# Altium schematic sheet dji_3s_battery.SchDoc: Smart Battery
size 762 x 508 mm; VersionControl_RevNumber: C; Date: Not shown in title block; DocumentNumber: 1; Revision: Use project parameter SCH_Rev; SheetNumber: 1; SheetTotal: 1; PageSetup: Record=PageOptions|CenterHorizontal=True|CenterVertical=True|PrintScale=1.00|XCorrection=1.00|YCorrection=1.00|PrintKind=0|BorderSize=5000000|LeftOffset=0|BottomOffset=0|Orientation=2|PaperLength=1000|PaperWidth=1000|Scale=100|PaperSource=15|PrintQuality=600|MediaType=1|DitherType=10|PaperKind=Letter|PrintScaleMode=1; CurrentTime: Not shown in title block; CurrentDate: Not shown in title block; Time: Not shown in title block; ModifiedDate: Not shown in title block
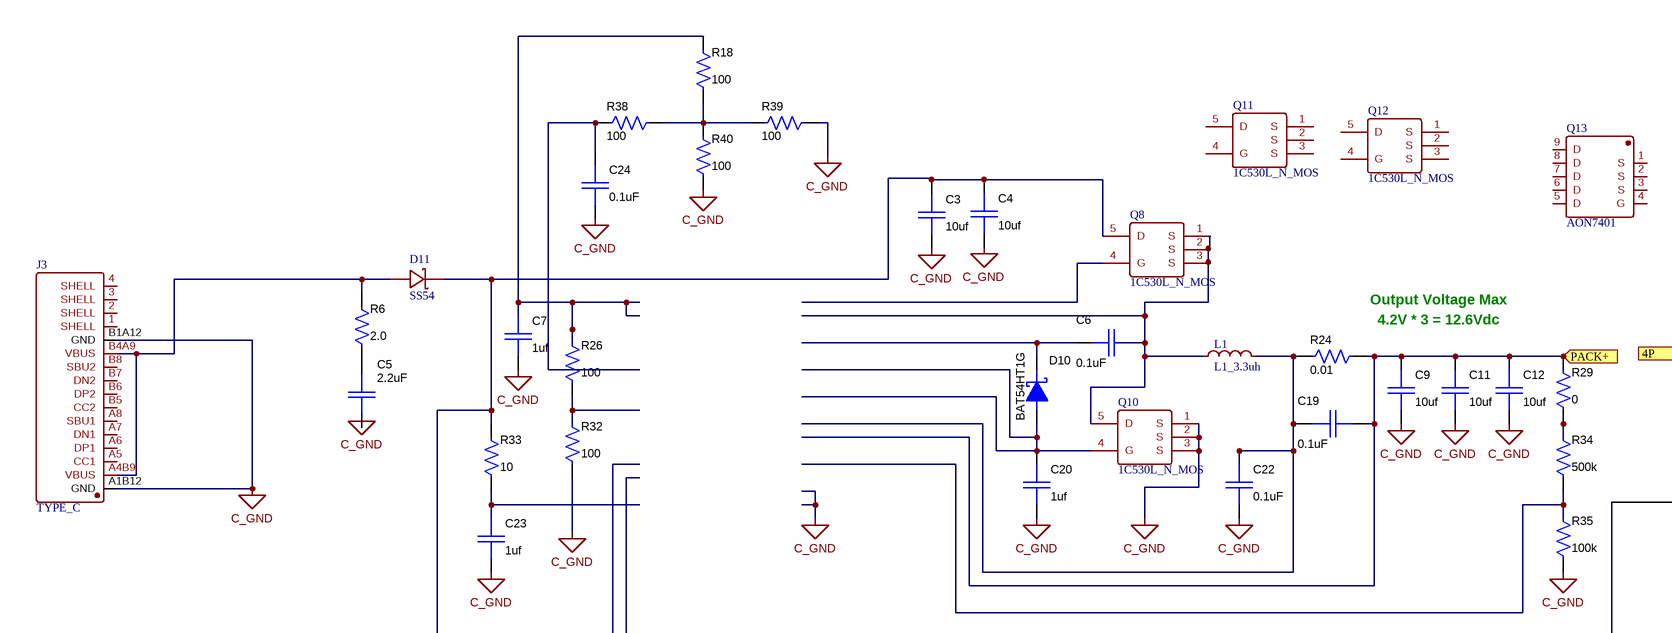
[diagram p0: dji_3s_battery.SchDoc, top left]
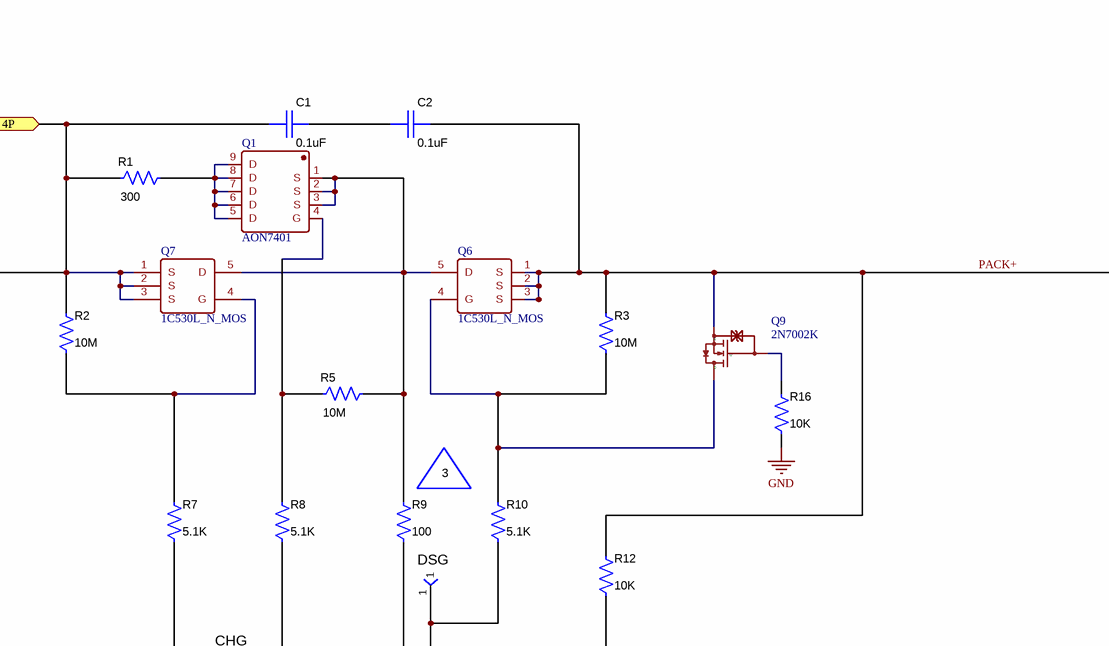
[diagram p1: dji_3s_battery.SchDoc, top right]
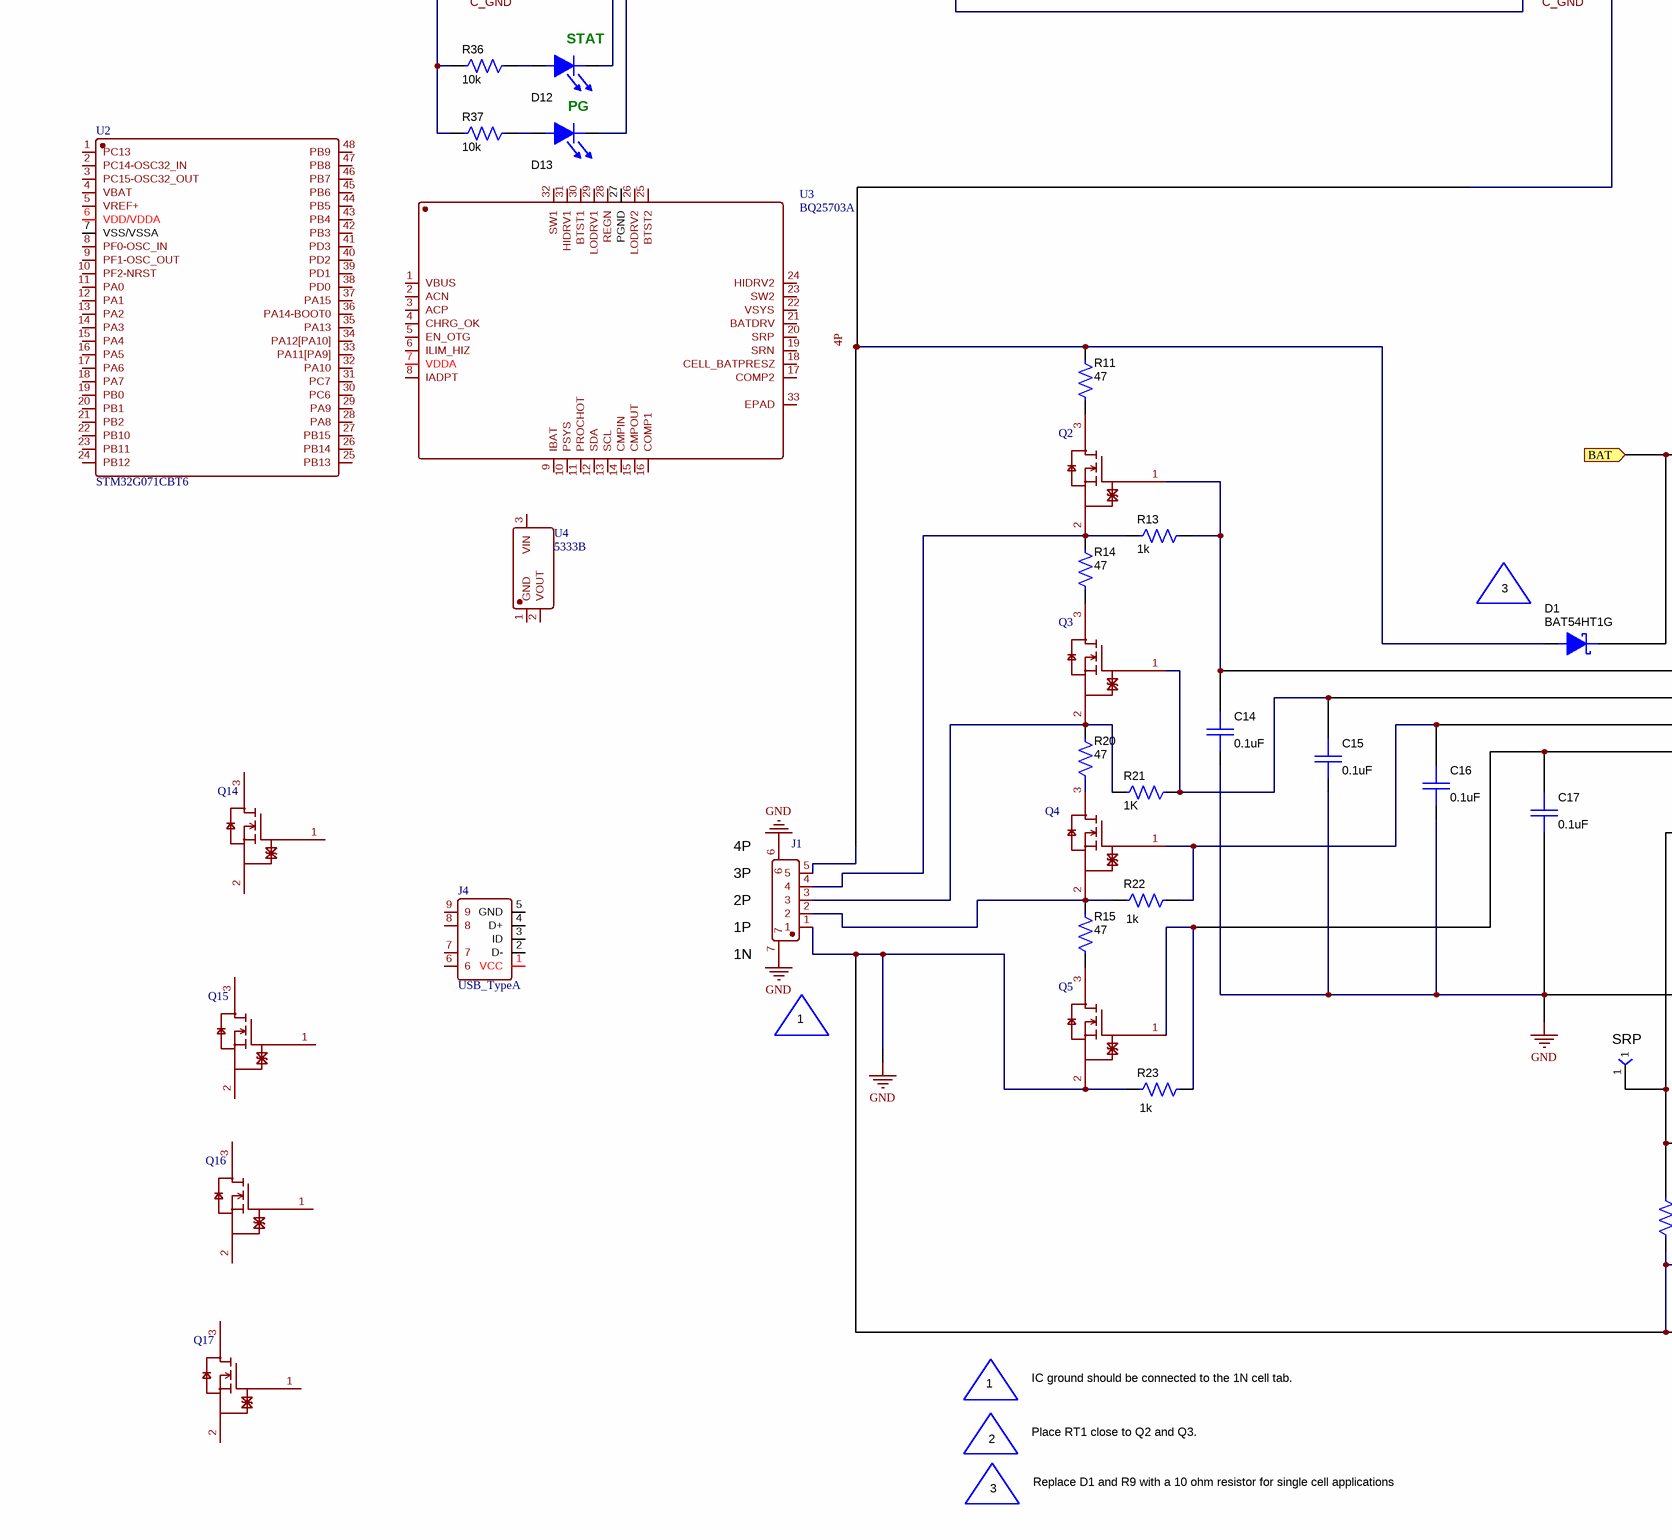
[diagram p2: dji_3s_battery.SchDoc, bottom left]
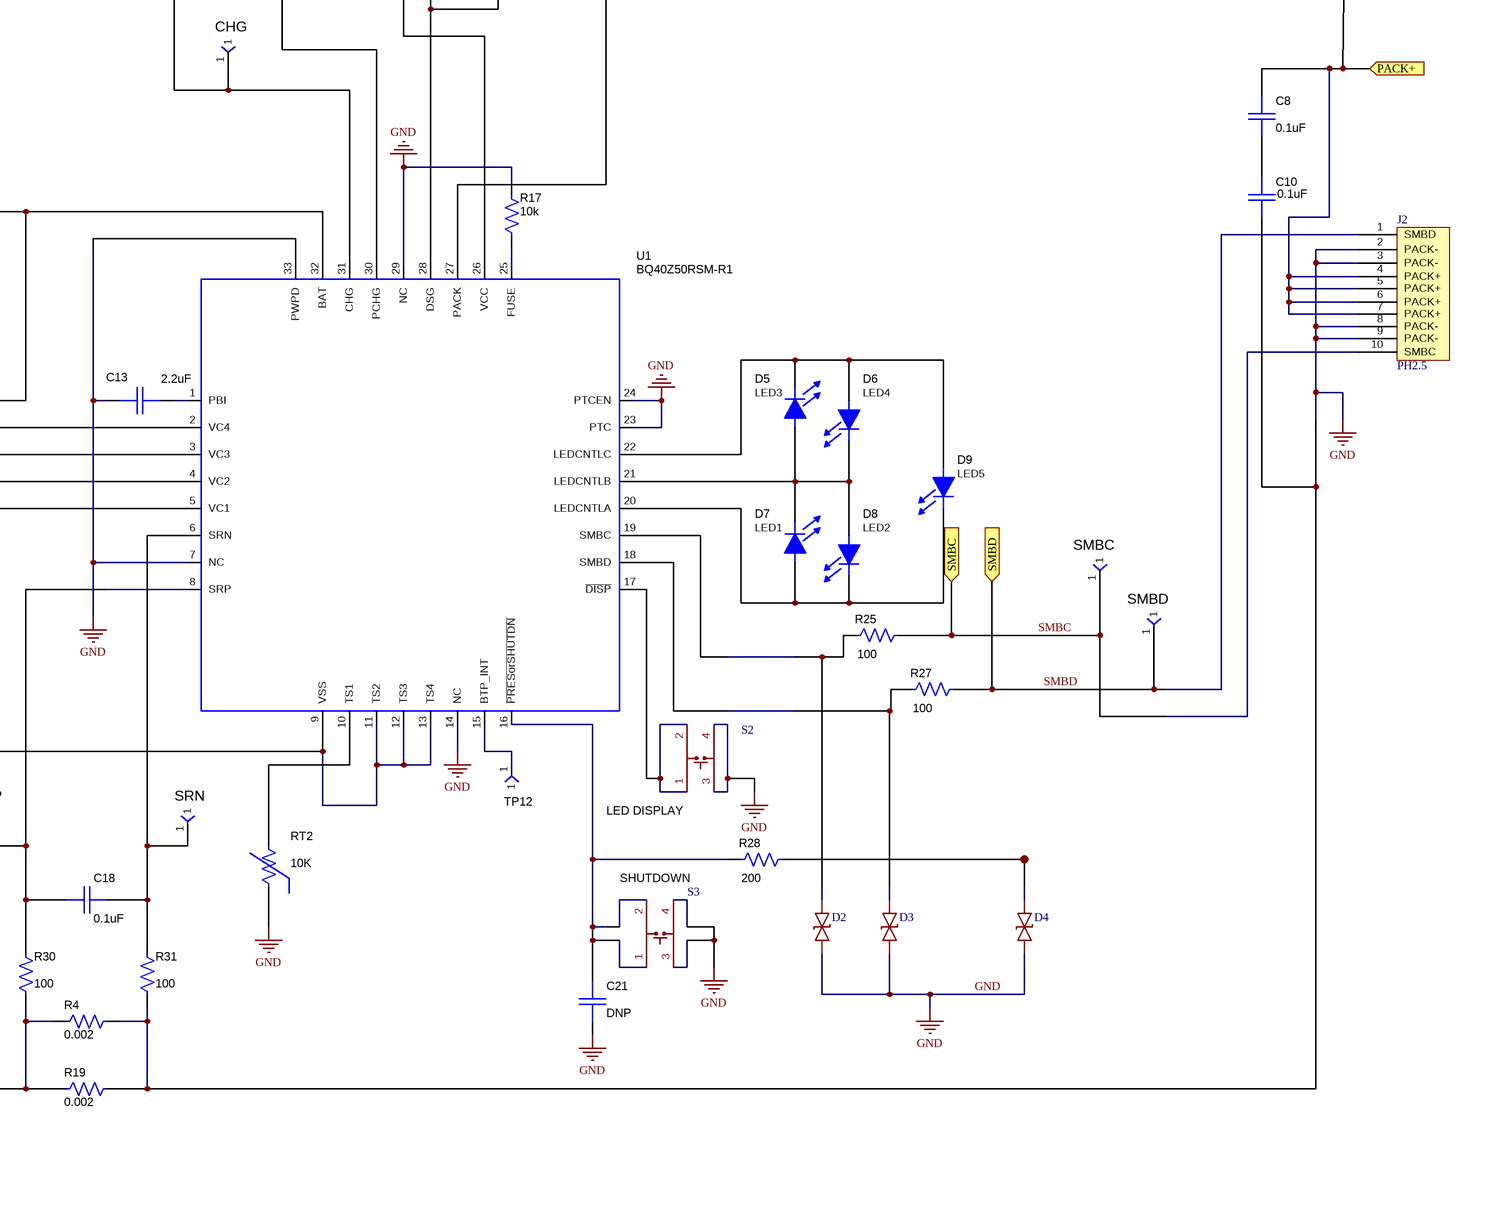
[diagram p3: dji_3s_battery.SchDoc, bottom right]

## Parts
C1  value 0.1uF  [C603]  (hidden comment: C0603C104M5RACTU)
C2  value 0.1uF  [C603]  (hidden comment: C0603C104M5RACTU)
C3  value 10uf  [C603]  (hidden comment: C0603C104M5RACTU)
C4  value 10uf  [C603]  (hidden comment: C0603C104M5RACTU)
C5  value 2.2uF  [C0805]  (hidden comment: C2012X7R1E225M085AB)
C6  value 0.1uF  [C603]  (hidden comment: C0603C104M5RACTU)
C7  value 1uf  [C603]  (hidden comment: C0603C104M5RACTU)
C8  value 0.1uF  [C603]  (hidden comment: C0603C104M5RACTU)
C9  value 10uf  [C603]  (hidden comment: C0603C104M5RACTU)
C10  value 0.1uF  [C603]  (hidden comment: C0603C104M5RACTU)
C11  value 10uf  [C603]  (hidden comment: C0603C104M5RACTU)
C12  value 10uf  [C603]  (hidden comment: C0603C104M5RACTU)
C13  value 2.2uF  [C0805]  (hidden comment: C2012X7R1E225M085AB)
C14  value 0.1uF  [C603]  (hidden comment: C0603C104M5RACTU)
C15  value 0.1uF  [C603]  (hidden comment: C0603C104M5RACTU)
C16  value 0.1uF  [C603]  (hidden comment: C0603C104M5RACTU)
C17  value 0.1uF  [C603]  (hidden comment: C0603C104M5RACTU)
C18  value 0.1uF  [C603]  (hidden comment: C0603C104M5RACTU)
C19  value 0.1uF  [C603]  (hidden comment: C0603C104M5RACTU)
C20  value 1uf  [C603]  (hidden comment: C0603C104M5RACTU)
C21  value DNP  [C603]  (hidden comment: C0603C104M5RACTU)
C22  value 0.1uF  [C603]  (hidden comment: C0603C104M5RACTU)
C23  value 1uf  [C603]  (hidden comment: C0603C104M5RACTU)
C24  value 0.1uF  [C603]  (hidden comment: C0603C104M5RACTU)
D1  value BAT54HT1G  [SOD-323]  (hidden comment: D-BAT54HT1)
D2  ESD_Diode  [ESD_Diode]  (value not drawn)
D3  ESD_Diode  [ESD_Diode]  (value not drawn)
D4  ESD_Diode  [ESD_Diode]  (value not drawn)
D5  D_LED_SML-LXR1206USBC-TR  [LED0805]  (value not drawn)
D6  D_LED_SML-LXR1206USBC-TR  [LED0805]  (value not drawn)
D7  D_LED_SML-LXR1206USBC-TR  [LED0805]  (value not drawn)
D8  D_LED_SML-LXR1206USBC-TR  [LED0805]  (value not drawn)
D9  D_LED_SML-LXR1206USBC-TR  [LED0805]  (value not drawn)
D10  value BAT54HT1G  [SOD-323]  (hidden comment: D-BAT54HT1)
D11  SS54  [SMA(DO-214AC)]
D12  D_LED_SML-LXR1206USBC-TR  [LED0805]  (value not drawn)
D13  D_LED_SML-LXR1206USBC-TR  [LED0805]  (value not drawn)
J1  SMD_1.25  [SMD_1.25]  (value not drawn)
J2  PH2.5  [PH2.5]
J3  TYPE_C  [TYPE_C]
J4  USB_TypeA  [USB_TypeA]
L1  L1_3.3uh  [3.3uh]
Q1  AON7401  [DFN-8]
Q2  DMN601K  [SOT-23 - duplicate]  (value not drawn)
Q3  DMN601K  [SOT-23 - duplicate]  (value not drawn)
Q4  DMN601K  [SOT-23 - duplicate]  (value not drawn)
Q5  DMN601K  [SOT-23 - duplicate]  (value not drawn)
Q6  1C530L_N_MOS  [LFPAK]
Q7  1C530L_N_MOS  [LFPAK]
Q8  1C530L_N_MOS  [LFPAK]
Q9  2N7002K  [2N7002K]
Q10  1C530L_N_MOS  [LFPAK]
Q11  1C530L_N_MOS  [LFPAK]
Q12  1C530L_N_MOS  [LFPAK]
Q13  AON7401  [DFN-8]
Q14  DMN601K  [SOT-23 - duplicate]  (value not drawn)
Q15  DMN601K  [SOT-23 - duplicate]  (value not drawn)
Q16  DMN601K  [SOT-23 - duplicate]  (value not drawn)
Q17  DMN601K  [SOT-23 - duplicate]  (value not drawn)
R1  value 300  [R2512]  (hidden comment: CRCW2512300RJNEG)
R2  value 10M  [0603]  (hidden comment: CRCW060310M0JNEA)
R3  value 10M  [0603]  (hidden comment: CRCW060310M0JNEA)
R4  value 0.002  [R2512]  (hidden comment: CRCW2512300RJNEG)
R5  value 10M  [0603]  (hidden comment: CRCW060310M0JNEA)
R6  value 2.0  [0603]  (hidden comment: CRCW0603100RJNEAHP)
R7  value 5.1K  [0603]  (hidden comment: CRCW06035K10JNEA)
R8  value 5.1K  [0603]  (hidden comment: CRCW06035K10JNEA)
R9  value 100  [0603]  (hidden comment: CRCW0603100RJNEAHP)
R10  value 5.1K  [0603]  (hidden comment: CRCW06035K10JNEA)
R11  value 47  [R1206]  (hidden comment: CSR1206-0R001F1)
R12  value 10K  [0603]  (hidden comment: CRCW060310K0JNEA)
R13  value 1k  [0603]  (hidden comment: CRCW0603100RJNEAHP)
R14  value 47  [R1206]  (hidden comment: CSR1206-0R001F1)
R15  value 47  [R1206]  (hidden comment: CSR1206-0R001F1)
R16  value 10K  [0603]  (hidden comment: CRCW060310M0JNEA)
R17  value 10k  [0603]  (hidden comment: CRCW06035K10JNEA)
R18  value 100  [0603]  (hidden comment: CRCW0603100RJNEAHP)
R19  value 0.002  [R2512]  (hidden comment: CRCW2512300RJNEG)
R20  value 47  [R1206]  (hidden comment: CSR1206-0R001F1)
R21  value 1K  [0603]  (hidden comment: CRCW0603100RJNEAHP)
R22  value 1k  [0603]  (hidden comment: CRCW0603100RJNEAHP)
R23  value 1k  [0603]  (hidden comment: CRCW0603100RJNEAHP)
R24  value 0.01  [R2512]  (hidden comment: CRCW2512300RJNEG)
R25  value 100  [0603]  (hidden comment: CRCW0603100RJNEAHP)
R26  value 100  [0603]  (hidden comment: CRCW0603100RJNEAHP)
R27  value 100  [0603]  (hidden comment: CRCW0603100RJNEAHP)
R28  value 200  [0603]  (hidden comment: CRCW0603200RJNEA)
R29  value 0  [0603]  (hidden comment: CRCW0603100RJNEAHP)
R30  value 100  [0603]  (hidden comment: CRCW0603100RJNEAHP)
R31  value 100  [0603]  (hidden comment: CRCW0603100RJNEAHP)
R32  value 100  [0603]  (hidden comment: CRCW0603100RJNEAHP)
R33  value 10  [0603]  (hidden comment: CRCW0603100RJNEAHP)
R34  value 500k  [0603]  (hidden comment: CRCW0603100RJNEAHP)
R35  value 100k  [0603]  (hidden comment: CRCW0603100RJNEAHP)
R36  value 10k  [0603]  (hidden comment: CRCW0603100RJNEAHP)
R37  value 10k  [0603]  (hidden comment: CRCW0603100RJNEAHP)
R38  value 100  [0603]  (hidden comment: CRCW0603100RJNEAHP)
R39  value 100  [0603]  (hidden comment: CRCW0603100RJNEAHP)
R40  value 100  [0603]  (hidden comment: CRCW0603100RJNEAHP)
RT2  value 10K  [C0805]  (hidden comment: 103AT-2)
S2  SW_SMD  [SW_SMD]  (value not drawn)
S3  SW_SMD  [SW_SMD]  (value not drawn)
TP1  TP_40_SMT  [TP_40_SMT]  (value not drawn)  (no BOM)
TP2  TP_.040_SMT  [TP_.040_SMT]  (value not drawn)  (no BOM)
TP5  TP_.040_SMT  [TP_.040_SMT]  (value not drawn)  (no BOM)
TP6  TP_.040_SMT  [TP_.040_SMT]  (value not drawn)  (no BOM)
TP9  TP_.040_SMT  [TP_.040_SMT]  (value not drawn)  (no BOM)
TP10  TP_.040_SMT  [TP_.040_SMT]  (value not drawn)  (no BOM)
TP12  TP_40_SMT  [TP_40_SMT]  (value not drawn)  (no BOM)
U1  value BQ40Z50RSM-R1  [QFP-32P_(RSM)]  (hidden comment: BQ40Z55RSM)
U2  STM32G071CBT6  [STM32G071CBT6]
U3  BQ25703A  [BQ25703A]
U4  5333B  [SOT-23 - duplicate]

## Ports
4P, BAT, PACK+, SMBC, SMBD

## Nets
C_GND: C3.1 C4.1 C7.1 C9.1 C11.1 C12.1 C20.1 C22.1 C23.1 C24.1 J3.A1B12(GND) J3.B1A12(GND) Q10.1(S) Q10.2(S) Q10.3(S) R32.1 R35.1 R39.1 R40.1
GND: C10.1 C13.1 C14.1 C15.1 C16.1 C17.1 C21.1 D2.1 D3.1 D4.1 J1.1 J1.6 J1.7 J2.2(PACK-) J2.3(PACK-) J2.8(PACK-) J2.9(PACK-) Q5.2(S) R4.1 R4.2 R16.1 R17.2 R19.1 R19.2 R23.1 R30.1 R31.1 RT2.1 S2.3 S2.4 S3.3 S3.4 U1.7(NC) U1.9(VSS) U1.11(TS2) U1.12(TS3) U1.13(TS4) U1.14(NC) U1.23(PTC) U1.24(PTCEN) U1.29(NC) U1.33(PWPD)
4P: C1.2 D1.2(A) J1.5 Q7.1(S) Q7.2(S) Q7.3(S) R1.1 R2.2 R11.1 ; port 4P
BAT: D1.1(C) U1.32(BAT) ; port BAT
PACK+: C2.1 C8.2 C9.2 C11.2 C12.2 C19.1 J2.4(PACK+) J2.5(PACK+) J2.6(PACK+) J2.7(PACK+) Q6.1(S) Q6.2(S) Q6.3(S) Q9.2(S) R3.2 R12.2 R24.2 R29.2 ; port PACK+
SMBC: J2.10(SMBC) R25.2 TP9.1 ; port SMBC
SMBD: J2.1(SMBD) R27.2 TP10.1 ; port SMBD
NetC1_1: C1.1 C2.2
NetC3_2: C3.2 C4.2 D11.2(K) Q8.5(D) R33.2 R36.2 R37.2
NetC5_2: C5.2 R6.1
NetC6_1: C6.1 L1.1 Q8.1(S) Q8.2(S) Q8.3(S) Q10.5(D)
NetC6_2: C6.2 D10.1(C)
NetC7_2: C7.2 R18.2 R26.2
NetC8_1: C8.1 C10.2
NetC13_2: C13.2 U1.1(PBI)
NetC14_2: C14.2 Q2.1(G) R13.2 U1.2(VC4)
NetC15_2: C15.2 Q3.1(G) R21.1 U1.3(VC3)
NetC16_2: C16.2 Q4.1(G) R22.2 U1.4(VC2)
NetC17_2: C17.2 Q5.1(G) R23.2 U1.5(VC1)
NetC18_1: C18.1 R31.2 TP2.1 U1.6(SRN)
NetC18_2: C18.2 R30.2 TP1.1 U1.8(SRP)
NetC19_2: C19.2 C22.2 L1.2 R24.1
NetC20_2: C20.2 D10.2(A) Q10.4(G)
NetC21_2: C21.2 R28.1 S3.1 S3.2 U1.16(~{PRESorSHUTDN})
NetC23_2: C23.2 R33.1
NetC24_2: C24.2 R38.2
NetD2_2: D2.2 R25.1 U1.19(SMBC)
NetD3_2: D3.2 R27.1 U1.18(SMBD)
NetD4_2: D4.2 R28.2
NetD5_1: D5.1(C) D6.2(A) D9.2(A) U1.22(LEDCNTLC)
NetD5_2: D5.2(A) D6.1(C) D7.1(C) D8.2(A) U1.21(LEDCNTLB)
NetD7_2: D7.2(A) D8.1(C) D9.1(C) U1.20(LEDCNTLA)
NetD11_1: D11.1(A) J3.A4B9(VBUS) J3.B4A9(VBUS) R6.2
NetD12_2: D12.2(A) R36.1
NetD13_2: D13.2(A) R37.1
NetJ1_2: J1.2 Q4.2(S) R15.2 R22.1
NetJ1_3: J1.3 Q3.2(S) R20.2 R21.2
NetJ1_4: J1.4 Q2.2(S) R13.1 R14.1
NetQ1_1: Q1.1(S) Q1.2(S) Q1.3(S) Q6.5(D) Q7.5(D) R5.2 R9.2
NetQ1_4: Q1.4(G) R5.1 R8.2
NetQ1_5: Q1.5(D) Q1.6(D) Q1.7(D) Q1.8(D) Q1.9(D) R1.2
NetQ2_3: Q2.3(D) R11.2
NetQ3_3: Q3.3(D) R14.2
NetQ4_3: Q4.3(D) R20.1
NetQ5_3: Q5.3(D) R15.1
NetQ6_4: Q6.4(G) Q9.3(D) R3.1 R10.2
NetQ7_4: Q7.4(G) R2.1 R7.2
NetQ9_1: Q9.1(G) R16.2
NetR7_1: R7.1 TP5.1 U1.31(CHG)
NetR8_1: R8.1 U1.30(PCHG)
NetR9_1: R9.1 U1.26(VCC)
NetR10_1: R10.1 TP6.1 U1.28(DSG)
NetR12_1: R12.1 U1.27(PACK)
NetR17_1: R17.1 U1.25(FUSE)
NetR18_1: R18.1 R38.1 R39.2 R40.2
NetR26_1: R26.1 R32.2
NetR29_1: R29.1 R34.2
NetR34_1: R34.1 R35.2
NetRT2_2: RT2.2 U1.10(TS1)
NetS2_1: S2.1 S2.2 U1.17(~{DISP})
NetTP12_1: TP12.1 U1.15(BTP_INT)

Not connected (* = marked no-connect by the designer): C5 1; D12 1(C); D13 1(C); J3 1(SHELL) 2(SHELL) 3(SHELL) 4(SHELL) A5(CC1) A6(DP1) A7(DN1) A8(SBU1) B5(CC2) B6(DP2) B7(DN2) B8(SBU2); J4 1(VCC) 2(D-) 3(ID) 4(D+) 5(GND) 6 7 8 9; Q8 4(G); Q11 1(S) 2(S) 3(S) 4(G) 5(D); Q12 1(S) 2(S) 3(S) 4(G) 5(D); Q13 1(S) 2(S) 3(S) 4(G) 5(D) 6(D) 7(D) 8(D) 9(D); Q14 1(G) 2(S) 3(D); Q15 1(G) 2(S) 3(D); Q16 1(G) 2(S) 3(D); Q17 1(G) 2(S) 3(D); U2 1(PC13) 2(PC14-OSC32_IN) 3(PC15-OSC32_OUT) 4(VBAT) 5(VREF+) 6(VDD/VDDA) 7(VSS/VSSA) 8(PF0-OSC_IN) 9(PF1-OSC_OUT) 10(PF2-NRST) 11(PA0) 12(PA1) 13(PA2) 14(PA3) 15(PA4) 16(PA5) 17(PA6) 18(PA7) 19(PB0) 20(PB1) 21(PB2) 22(PB10) 23(PB11) 24(PB12) 25(PB13) 26(PB14) 27(PB15) 28(PA8) 29(PA9) 30(PC6) 31(PC7) 32(PA10) 33(PA11[PA9]) 34(PA12[PA10]) 35(PA13) 36(PA14-BOOT0) 37(PA15) 38(PD0) 39(PD1) 40(PD2) 41(PD3) 42(PB3) 43(PB4) 44(PB5) 45(PB6) 46(PB7) 47(PB8) 48(PB9); U3 1(VBUS) 2(ACN) 3(ACP) 4(CHRG_OK) 5(EN_OTG) 6(ILIM_HIZ) 7(VDDA) 8(IADPT) 9(IBAT) 10(PSYS) 11(PROCHOT) 12(SDA) 13(SCL) 14(CMPIN) 15(CMPOUT) 16(COMP1) 17(COMP2) 18(CELL_BATPRESZ) 19(SRN) 20(SRP) 21(BATDRV) 22(VSYS) 23(SW2) 24(HIDRV2) 25(BTST2) 26(LODRV2) 27(PGND) 28(REGN) 29(LODRV1) 30(BTST1) 31(HIDRV1) 32(SW1) 33(EPAD); U4 1(GND) 2(VOUT) 3(VIN)

## Notes on the sheet
- 4.2V * 3 = 12.6Vdc
- Output Voltage Max
- (near D12) STAT
- PG
- 3
- DSG
- (near TP5) CHG
- (near D5) LED3
- (near D6) LED4
- (near D9) LED5
- (near D7) LED1
- (near D8) LED2
- (near TP9) SMBC
- (near J1) 2P
- (near J1) 4P
- (near J1) 3P
- (near TP10) SMBD
- (near J1) 1P
- (near J1) 1N
- 1
- (near TP1) SRP
- (near TP2) SRN
- (near S2) LED DISPLAY
- (near S3) SHUTDOWN
- IC ground should be connected to the 1N cell tab.
- Place RT1 close to Q2 and Q3.
- 2
- Replace D1 and R9 with a 10 ohm resistor for single cell applications
- Labels drawn without touching a wire or pin: 4P, C_GND
- Drawn By:
- SVN Rev:
- Number:
- TID #:
- Orderable:
- Rev:
- Sheet Title:
- File:
- Project Title:
- Designed for:
- Assembly Variant:
- Mod. Date:
- Sheet:
- Size:
- of
- C
- http://www.ti.com
- Texas Instruments and/or its licensors do not warrant the accuracy or completeness of this specification or any information contained therein. Texas Instruments and/or its licensors do not warrant that this design will meet the specifications, will be suitable for your application or fit for any particular purpose, or will operate in an implementation. Texas Instruments and/or its licensors do not warrant that the design is production worthy. You should completely validate and test your design implementation to confirm the system functionality for your application.
- Engineer:
- Contact:
- © Texas Instruments

## Library data of the parts
C1-C4 C6-C12 C14-C24 = C0603: Capacitor, Ceramic Chip, 50V, X7R, ±20%; Manufacturer: Kemet; Area: 5650; ComponentHeight: 0.035 inch; SymbolVersion: 07/31/2009 12:17:27; PartNumber: C0603C104M5RACTU; PackageReference: 603; ComponentLink1Description: AEO Datasheet Link
C5 C13 = C0805: Capacitor, Ceramic Chip, 25V, X7R ±20%; Manufacturer: TDK; Area: 10560; ComponentHeight: 0.053 inch; SymbolVersion: 06/23/2010 08:22:44; PartNumber: C2012X7R1E225M085AB; PackageReference: 805; ComponentLink1Description: AEO Datasheet Link
D1 D10 = D-BAT54HT1: Diode, Schottky, 200-mA, 30-V; Manufacturer: On Semi; Area: 14105; ComponentHeight: 0.043 inch; ComponentLink1URL: \\vette02\pmp_pcb\pcad_pdf's\BAT54HT1-D.pdf; SymbolVersion: 02/28/2007 14:26:03; PackageReference: SOD323; PartNumber: BAT54HT1G; ComponentLink1Description: AEO Datasheet Link
D5-D9 D12 D13 = D_LED_SML-LXR1206USBC-TR: Diode, LED, 2X3mm 565nm GRN WTR CLR SMD; PartNumber: SML-LX23GC; Manufacturer: Lumex; Area: 22000; Value: SML-LX23GC; ComponentLink1URL: \\vette02\pmp_pcb\pcad_pdf's\SML-LXR1206USBC-TR[1].pdf; SymbolVersion: 08/01/2007 15:25:38; PackageReference: 1206; ComponentHeight: 0.041 inch; ComponentLink1Description: AEO Datasheet Link
R1 R4 R19 R24 = R2512_5%: Resistor, Chip 1W, 5%; Manufacturer: Vishay-Dale; Area: 56,000; SymbolVersion: 05/06/2011 14:04:06; PackageReference: 2512; PartNumber: CRCW2512300RJNEG; ComponentLink1Description: AEO Datasheet Link
R2 R3 R5-R10 R12 R13 R16-R18 R21-R23 R25-R27 R29-R40 = R0603_1%: Resistor, Chip, 1/10W, 5%; Manufacturer: Vishay-Dale; Area: 9100; SymbolVersion: 05/06/2011 13:51:33; PackageReference: 603; ComponentLink1Description: AEO Datasheet Link
  R2 R3 R5 R16: PartNumber: CRCW060310M0JNEA
  R6 R9 R13 R18 R21-R23 R25-R27 R29-R40: PartNumber: CRCW0603100RJNEAHP
  R7 R8 R10 R17: PartNumber: CRCW06035K10JNEA
  R12: PartNumber: CRCW060310K0JNEA
R11 R14 R15 R20 = R1206_1%: Resistor, Chip 1 watt, ±1%, 50 ppm; Manufacturer: Reidon; Area: 20,000; SymbolVersion: 05/06/2011 13:59:00; PackageReference: 1206; PartNumber: CSR1206-0R001F1; ComponentLink1Description: AEO Datasheet Link
R28 = R0603_1%: Resistor, Chip, 1/16W, 5%; Manufacturer: Vishay-Dale; Area: 9100; SymbolVersion: 05/06/2011 13:51:33; PackageReference: 603; PartNumber: CRCW0603200RJNEA; ComponentLink1Description: AEO Datasheet Link
RT2 = THERMISTOR-103AT: Thermistor, NTC, 3-A; Manufacturer: Semitec; Area: 25,000; ComponentHeight: 0.335 inch; ComponentLink1URL: \\vette02\pmp_pcb\pcad_pdf's\AT_Thermistor.pdf; PackageReference: 0.095 X 0.150 inch; SymbolVersion: 07/31/2009 12:17:31; PartNumber: 103AT-2; ComponentLink1Description: AEO Datasheet Link
TP1 TP12 = TP_40_SMT: Test point, 40 mil SMT; Manufacturer: None; Value: None; ComponentHeight: None; SymbolVersion: 07/13/2010 09:50:06; area: *; PackageReference: None; PartNumber: None; ComponentLink1Description: AEO Datasheet Link
TP2 TP5 TP6 TP9 TP10 = TP_.040_SMT: Test point, 40 mil SMT; Value: None; ComponentHeight: None; area: *; SymbolVersion: 11/01/2006 14:05:31; PackageReference: None; Manufacturer: None; PartNumber: None; ComponentLink1Description: AEO Datasheet Link
U1 = BQ40Z55RSM: IC, 2 to 4-Series Li-Ion Battery Pack Manager; Manufacturer: TI; Alternate Manufacturer: None; Area: 51072; ComponentHeight: 0.04mil; ComponentLink1URL: \\vette02\pmp_pcb\pcad_pdf's\bq40z55_DS.pdf; SymbolVersion: 06/22/2012 10:16:53; PackageReference: QFN; PartNumber: BQ40Z50RSM-R1; ComponentLink1Description: AEO Datasheet Link